# Altium schematic sheet psu.SchDoc
size A
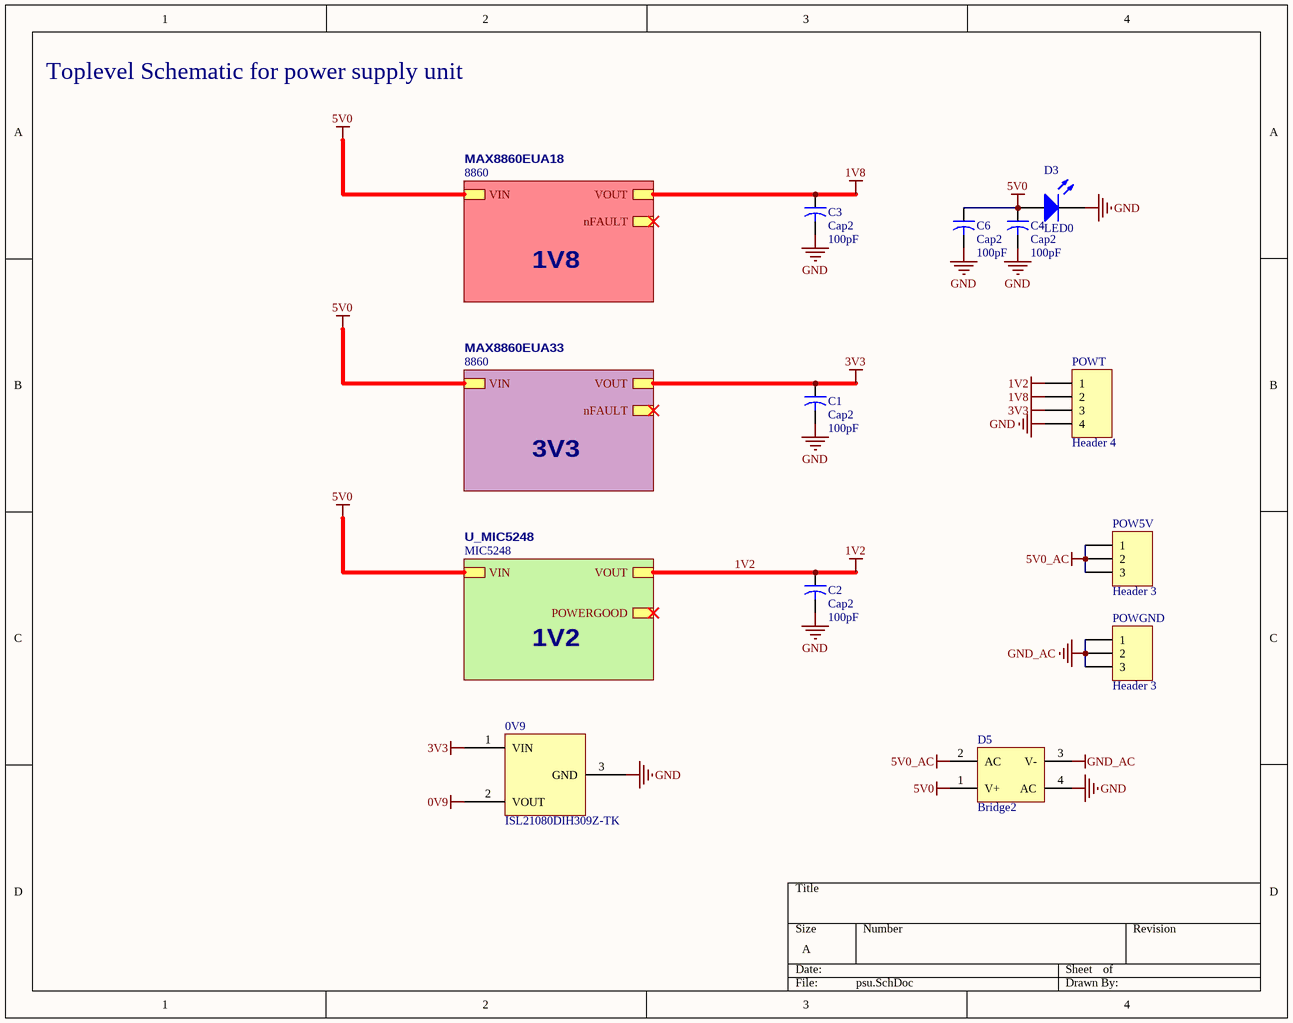
[diagram p0: psu.SchDoc]

## Parts
0V9  ISL21080DIH309Z-TK
C1  Cap2  value 100pF  [CAPR5-4X5]
C2  Cap2  value 100pF  [CAPR5-4X5]
C3  Cap2  value 100pF  [CAPR5-4X5]
C4  Cap2  value 100pF  [CAPR5-4X5]
C6  Cap2  value 100pF  [CAPR5-4X5]
D3  LED0  [LED-0]
D5  Bridge2  [4 in line socket]
POW5V  Header 3  [HDR1X3]
POWGND  Header 3  [HDR1X3]
POWT  Header 4  [HDR1X4]

## Sub-sheets
MAX8860EUA18 = 8860: VIN, VOUT, nFAULT
MAX8860EUA33 = 8860: VIN, VOUT, nFAULT
U_MIC5248 = MIC5248: VIN, VOUT, POWERGOOD

## Nets
0V9: 0V9.2(VOUT)
1V2: C2.1 POWT.1 ; sheet U_MIC5248/VOUT
1V8: C3.1 POWT.2 ; sheet MAX8860EUA18/VOUT
3V3: 0V9.1(VIN) C1.1 POWT.3 ; sheet MAX8860EUA33/VOUT
5V0: C4.1 C6.1 D3.1(A) D5.1(V+) ; sheet MAX8860EUA18/VIN, sheet MAX8860EUA33/VIN, sheet U_MIC5248/VIN
5V0_AC: D5.2(AC) POW5V.1 POW5V.2 POW5V.3
GND: 0V9.3(GND) C1.2 C2.2 C3.2 C4.2 C6.2 D3.2(K) D5.4(AC) POWT.4
GND_AC: D5.3(V-) POWGND.1 POWGND.2 POWGND.3

## Notes on the sheet
- Toplevel Schematic for power supply unit
- 1V8
- 3V3
- 1V2

## Library data of the parts
C1-C4 C6 = Cap2: Capacitor; Published: 23-Sep-2002; PackageReference: CAPR5-4X5; Publisher: Altium Limited; PackageDescription: Capacitor; 2 Leads
D3 = LED0: Typical INFRARED GaAs LED; Published: 8-Jun-2000; LatestRevisionDate: 08-Jul-2005; LatestRevisionNote: Mech Layer 1 removed.; PackageReference: LED-0; Publisher: Altium Limited; PackageDescription: LED; 2 Leads
D5 = Bridge2: Diode Bridge; Published: 24-Mar-1999; LatestRevisionDate: 17-Jul-2002; LatestRevisionNote: Re-released for DXP Platform.; PackageReference: D-46_6A; Publisher: Altium Limited; PackageDescription: Bridge Rectifier; 4 Terminals; Body 16.8 x 16.8 mm (typ); Pitch 10.67 mm
POW5V POWGND = Header 3: Header, 3-Pin; LatestRevisionDate: 17-Jul-2002; LatestRevisionNote: Re-released for DXP Platform.; Publisher: Altium Limited
POWT = Header 4: Header, 4-Pin; LatestRevisionDate: 17-Jul-2002; LatestRevisionNote: Re-released for DXP Platform.; Publisher: Altium Limited